# EAGLE design VHF-Superregen-2-Transistor (EAGLE 7.6.0)
A Superregen Receiver for FM broadcast or Aircraft band AM reception http://www.ke3ij.com/superrgn.htm
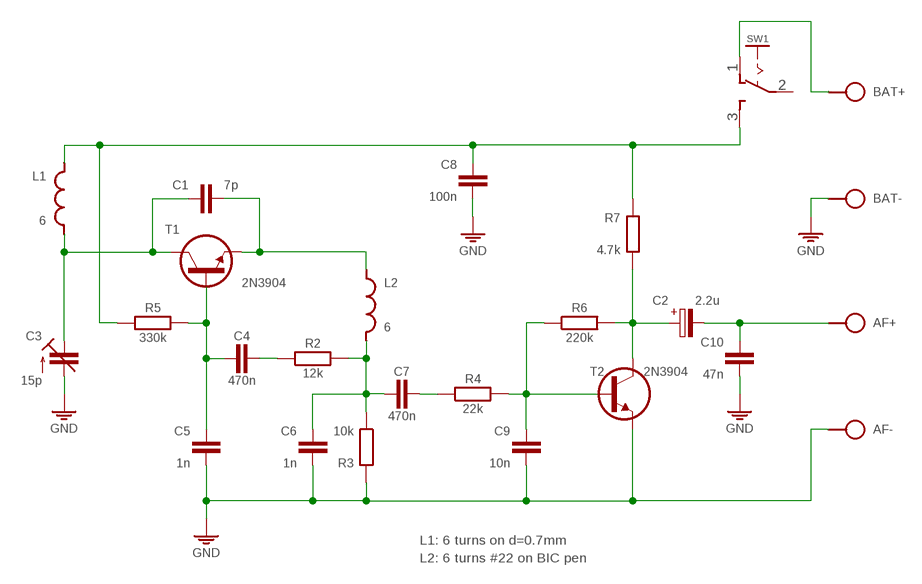
[diagram p0: schematic, sheet 1]

## Parts
AF+  SPAD  [SPAD]
AF-  SPAD  [SPAD]
BAT+  SPAD  [SPAD]
BAT-  SPAD  [SPAD]
C1  7p  C050-020X036  [C050-020X036]
C2  2.2u  CPOLE2,5-3  [E2,5-3]
C3  15p  C-TR-PH201272222-808-2PINB  [TRIM-2222-808]
C4  470n  C050-024X044/V  [C050-024X044/V]
C5  1n  C025-020X036  [C025-020X036]
C6  1n  C025-020X036  [C025-020X036]
C7  470n  C050-024X044/V  [C050-024X044/V]
C8  100n  C050-020X044/V  [C050-020X044/V]
C9  10n  C050-020X036/V  [C050-020X036/V]
C10  47n  C050-020X036  [C050-020X036]
L1  6  L-SHORTL-04/7V  [L-04/7V]
L2  6  L-SHORTL-04/7V  [L-04/7V]
R2  12k  R-H0202/7-V  [0202/7-V]
R3  10k  R0202/7  [0202/7]
R4  22k  R-H0202/7-V  [0202/7-V]
R5  330k  R-H0202/7-V  [0202/7-V]
R6  220k  R-H0202/7-V  [0202/7-V]
R7  4.7k  R0202/7-V  [0202/7-V]
SW1  SL-SW-1P-2T-H  [SLSW-1P2T-H]
T1  2N3904  [TO92]
T2  2N3904  [TO92]

## Nets
GND: AF-.1 BAT-.1 C3.2(A) C5.2 C6.2 C8.2 C9.2 C10.2 R3.2 T2.1(E)
N$1: C1.2 C3.3(E) L1.1 T1.3(C)
N$2: C1.1 L2.2 T1.1(E)
N$3: C7.1 R4.1
N$4: C4.2 C5.1 R5.2 T1.2(B)
N$5: C2.+ R6.2 R7.1 T2.3(C)
N$6: C6.1 C7.2 L2.1 R2.2 R3.1
N$7: C4.1 R2.1
N$9: BAT+.1 SW1.1(O)
N$10: C9.1 R4.2 R6.1 T2.2(B)
N$11: AF+.1 C2.- C10.1
VCC: C8.1 L1.2 R5.1 R7.2 SW1.3(S)
Unconnected: SW1.2(P)

## Notes on the sheet
- L1: 6 turns on d=0.7mm
- L2: 6 turns #22 on BIC pen

## Library data of the parts
AF+ AF- BAT+ BAT- = pad:SPAD
C1 C4-C10 = c:C: CAPACITOR, European symbol
C2 = c:CPOL: POLARIZED CAPACITOR, European symbol
C3 = cap-trim:C-TR-PH20127
L1 L2 = l:L-SHORT
R2 R4-R6 = r:R-H
R3 R7 = r:R: RESISTOR, European symbol
SW1 = sw:SL-SW-1P-2T
T1 T2 = t:2N3904

## Net classes
0 default: width 0.61 mm

## Board
A Superregen Receiver for FM broadcast or Aircraft band AM reception http://www.ke3ij.com/superrgn.htm
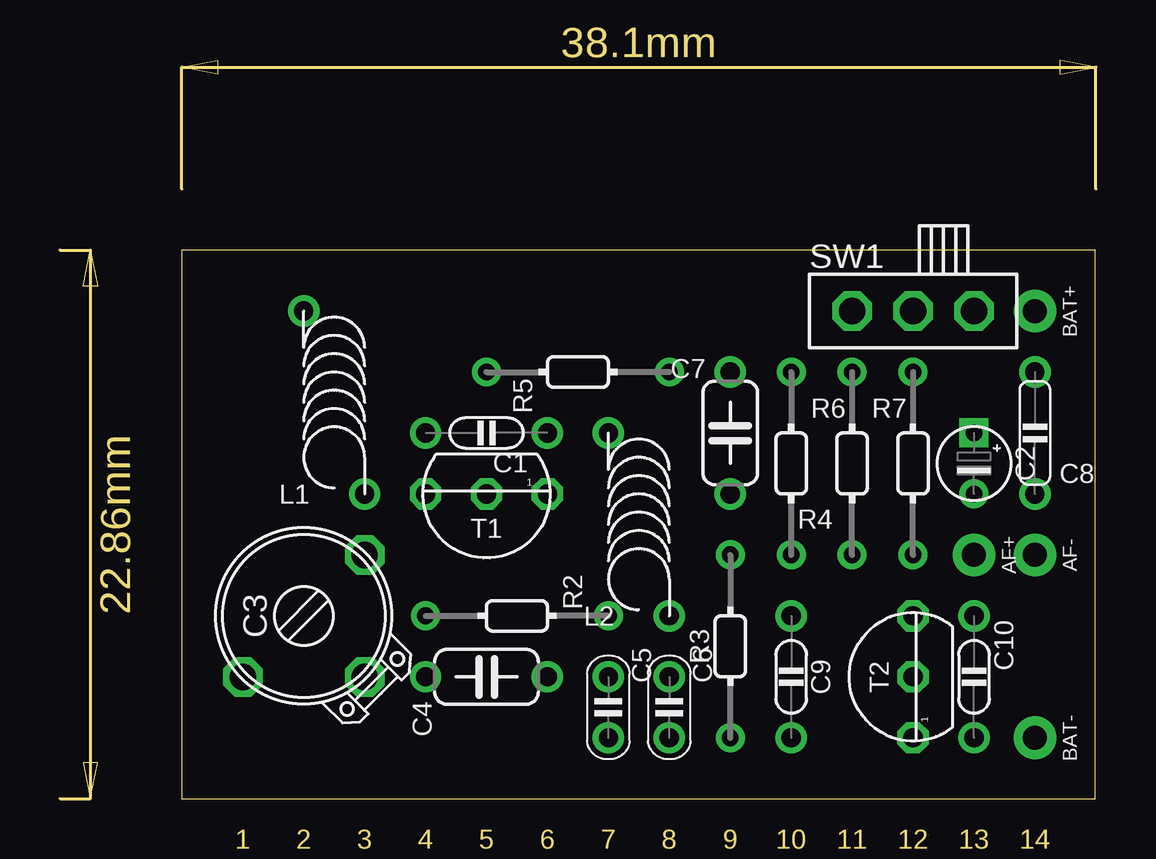
[diagram p1: board, top side]
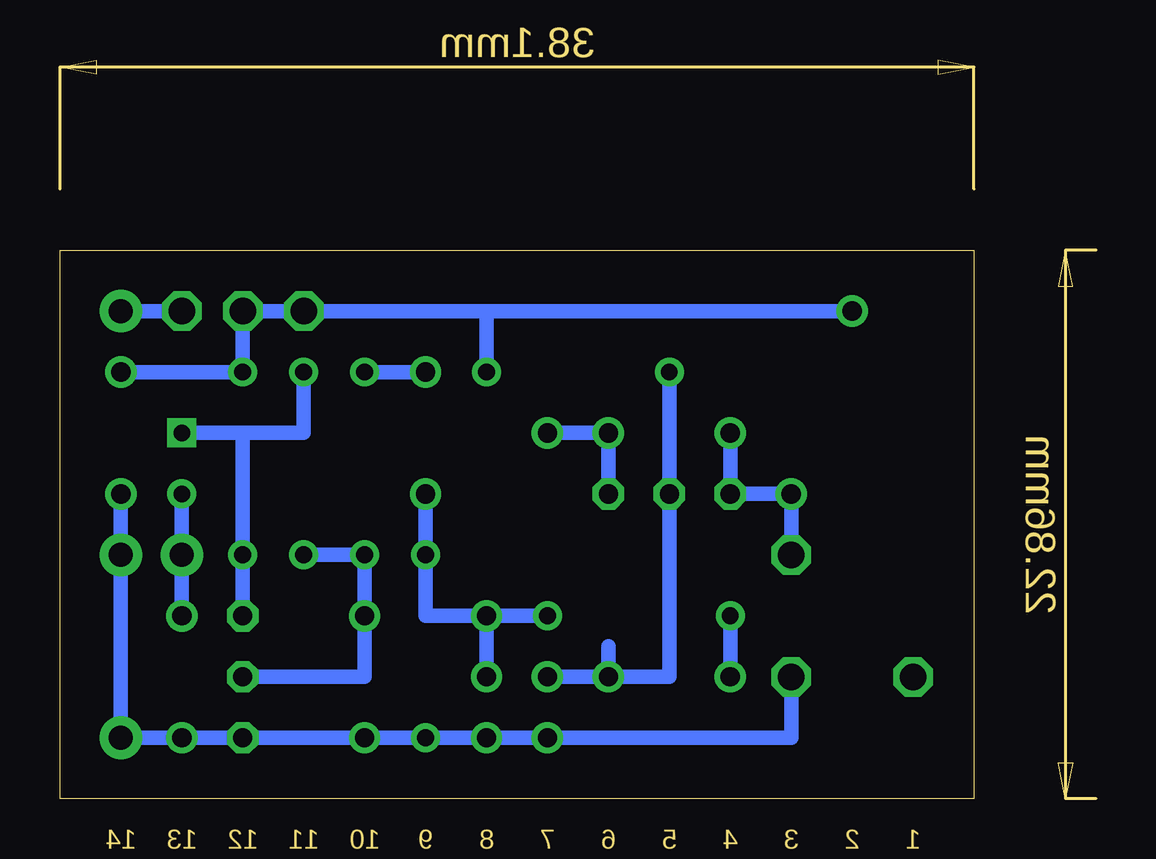
[diagram p2: board, bottom side, seen from below]

Size 38.08 x 22.86 mm. Coordinates in mm from the lower left corner, seen from the top.
Outline: 0,0 38.08,0 38.08,22.86 0,22.86 0,0
Copper layers (1*16): Top 0.035mm / dielectric 1.5mm / Bottom 0.035mm
Design rules "default": minimum track width 10mil, minimum drill 24mil, track to track 8mil, track to pad 8mil, pad to pad 8mil, via to via 8mil, smd to smd 8mil, copper to edge 40mil, drill to drill 8mil, minimum pad ring 10mil, minimum via ring 8mil, stop-mask expansion 4mil, vias tented up to drill 0mil, thermal gap 10mil

### Footprints (pad centres in the part's own frame; a part is rotated, then mirrored left to right if it is on the bottom)
SPAD = drill 1 pad 1.778: 1 0,0
C050-020X036 = drill 0.8: 1 -2.54,0; 2 2.54,0
E2,5-3 = drill 0.7 square: + 0,1.27 | drill 0.7: - 0,-1.27
TRIM-2222-808 = drill 1.1 octagon: 1 -2.54,2.54; 2 -2.54,-2.54; 3 2.54,-2.54
C050-024X044/V = drill 0.8: 1 0,2.54; 2 0,-2.54
C025-020X036 = drill 0.8: 1 0,0; 2 2.54,0
C050-020X044/V = drill 0.8: 1 0,-2.54; 2 0,2.54
C050-020X036/V = drill 0.8: 1 0,-2.54; 2 0,2.54
L-04/7V = drill 0.8: 1 1.27,-5.08; 2 -1.27,2.54
0202/7-V = drill 0.7: 1 0,-3.81; 2 0,3.81
0202/7 = drill 0.7: 1 0,3.81; 2 0,-3.81
SLSW-1P2T-H = drill 1.1 pad 1.524 octagon: 1 2.54,0; 2 0,0; 3 -2.54,0
TO92 = drill 0.8 octagon: 1 -2.54,0; 2 0,0; 3 2.54,0

### Placement (x,y rotation side)
AF+  33.02,10.16 180 top
AF-  35.56,10.16 180 top
BAT+  35.56,20.32 180 top
BAT-  35.56,2.54 180 top
C1  12.7,15.24 180 top
C2  33.02,13.97 0 top
C3  5.08,7.62 90 top
C4  12.7,5.08 90 top
C5  17.78,5.08 270 top
C6  20.32,5.08 270 top
C7  22.86,15.24 0 top
C8  35.56,15.24 180 top
C9  25.4,5.08 180 top
C10  33.02,5.08 270 top
L1  6.35,17.78 0 top
L2  19.05,12.7 0 top
R2  13.97,7.62 270 top
R3  22.86,6.35 0 top
R4  25.4,13.97 180 top
R5  16.51,17.78 90 top
R6  27.94,13.97 0 top
R7  30.48,13.97 0 top
SW1  30.48,20.32 0 top
T1  12.7,12.7 180 top
T2  30.48,5.08 90 top

### Tracks (layer width: path | path; a pad name or v marks a point on that pad's centre or on a via)
GND
  Bottom 0.61: C3.2 7.62,2.54 C5.2 C6.2 R3.2 C9.2 T2.1 C10.2 BAT-.1 AF-.1 C8.2
N$1
  Bottom 0.61: C3.3 L1.1 T1.3 C1.2
N$2
  Bottom 0.61: T1.1 C1.1 L2.2
N$3
  Bottom 0.61: C7.1 R4.1
N$4
  Bottom 0.61: R5.2 T1.2 12.7,5.08 C4.2 | C4.2 15.24,6.35 | C4.2 C5.1
N$5
  Bottom 0.61: 30.48,15.24 R7.1 T2.3 | 30.48,15.24 C2.+ | R6.2 27.94,15.24 30.48,15.24
N$6
  Bottom 0.61: C7.2 R3.1 22.86,7.62 L2.1 | C6.1 L2.1 | L2.1 R2.2
N$7
  Bottom 0.61: R2.1 C4.1
N$9
  Bottom 0.61: SW1.1 BAT+.1
N$10
  Bottom 0.61: R6.1 R4.2 C9.1 25.4,5.08 T2.2
N$11
  Bottom 0.61: C2.- AF+.1 C10.1
VCC
  Bottom 0.61: R5.1 20.32,20.32 | 20.32,20.32 L1.2 | C8.1 R7.2 30.48,20.32 SW1.3 20.32,20.32

### Text on the board
Dimension: 8 | 7 | 6 | 5 | 4 | 3 | 2 | 1 | 1 | 2 | 3 | 4 | 5 | 6 | 7 | 8 | 9 | 10 | 11 | 12 | 13 | 14